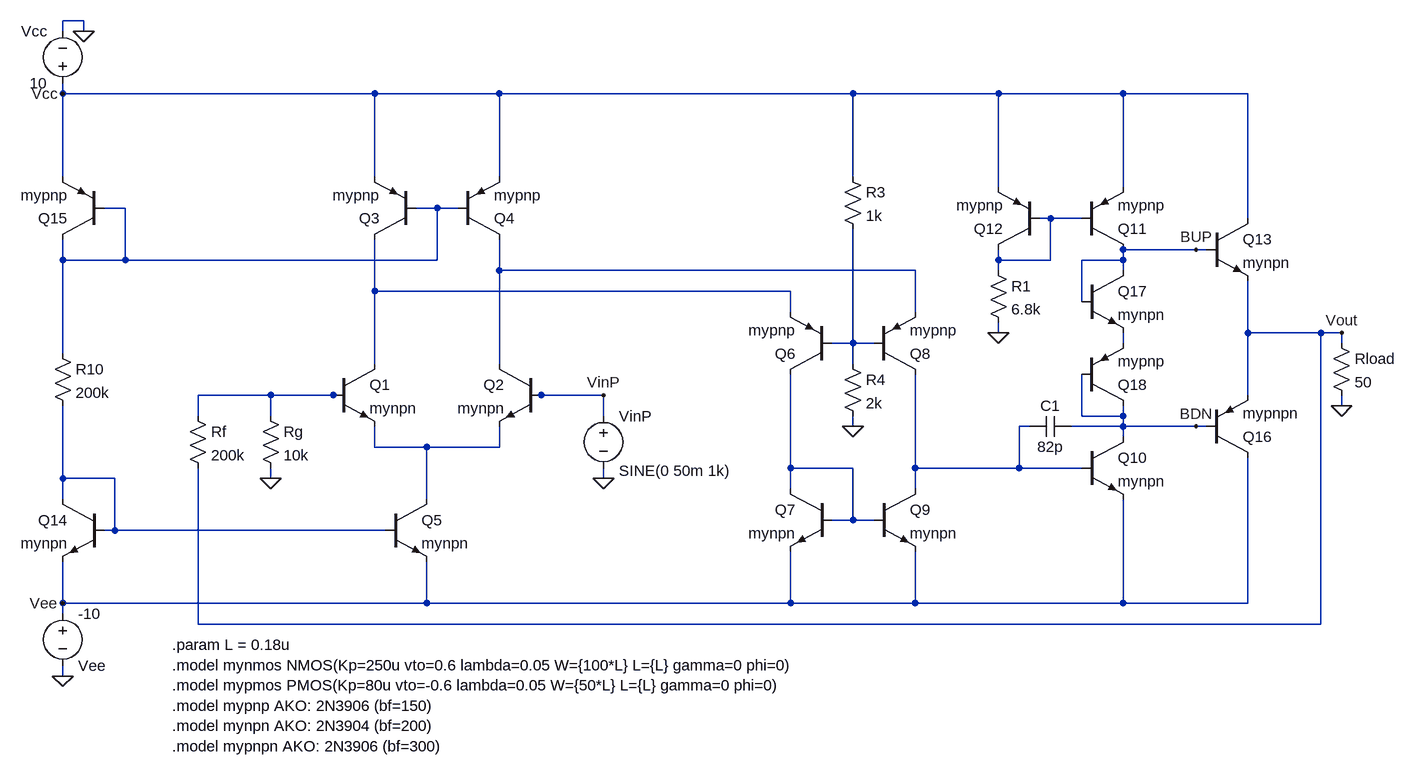
[diagram p0: schematic Ph2_403170569.asc]
Ph2_403170569.asc, the LTspice schematic file:
Version 4.1
SHEET 1 2160 844
WIRE -176 -784 -208 -784
WIRE -208 -768 -208 -784
WIRE -176 -768 -176 -784
WIRE -208 -672 -208 -688
WIRE 272 -672 -208 -672
WIRE 464 -672 272 -672
WIRE 1008 -672 464 -672
WIRE 1232 -672 1008 -672
WIRE 1424 -672 1232 -672
WIRE 1616 -672 1424 -672
WIRE -208 -544 -208 -672
WIRE 272 -544 272 -672
WIRE 464 -544 464 -672
WIRE 1008 -544 1008 -672
WIRE 1232 -528 1232 -672
WIRE 1424 -528 1424 -672
WIRE -112 -496 -144 -496
WIRE 368 -496 336 -496
WIRE 400 -496 368 -496
WIRE 1312 -480 1296 -480
WIRE 1360 -480 1312 -480
WIRE 1616 -480 1616 -672
WIRE 1536 -432 1424 -432
WIRE 1552 -432 1536 -432
WIRE -208 -416 -208 -448
WIRE -112 -416 -112 -496
WIRE -112 -416 -208 -416
WIRE 368 -416 368 -496
WIRE 368 -416 -112 -416
WIRE 1232 -416 1232 -432
WIRE 1312 -416 1312 -480
WIRE 1312 -416 1232 -416
WIRE 1424 -416 1424 -432
WIRE 1424 -416 1360 -416
WIRE 464 -400 464 -448
WIRE 1104 -400 464 -400
WIRE 1232 -400 1232 -416
WIRE 1424 -400 1424 -416
WIRE 272 -368 272 -448
WIRE 912 -368 272 -368
WIRE 1360 -352 1360 -416
WIRE 912 -336 912 -368
WIRE 1104 -336 1104 -400
WIRE 1232 -304 1232 -320
WIRE 1616 -304 1616 -384
WIRE 1728 -304 1616 -304
WIRE 1760 -304 1728 -304
WIRE 1008 -288 1008 -464
WIRE 1008 -288 976 -288
WIRE 1040 -288 1008 -288
WIRE 1424 -288 1424 -304
WIRE 1760 -288 1760 -304
WIRE -208 -272 -208 -416
WIRE 272 -256 272 -368
WIRE 464 -256 464 -400
WIRE 1008 -256 1008 -288
WIRE 112 -208 0 -208
WIRE 208 -208 112 -208
WIRE 224 -208 208 -208
WIRE 528 -208 512 -208
WIRE 624 -208 528 -208
WIRE 1616 -208 1616 -304
WIRE 1760 -192 1760 -208
WIRE 0 -176 0 -208
WIRE 112 -176 112 -208
WIRE 624 -176 624 -208
WIRE 1360 -176 1360 -240
WIRE 1424 -176 1424 -192
WIRE 1424 -176 1360 -176
WIRE 1008 -160 1008 -176
WIRE 1280 -160 1264 -160
WIRE 1424 -160 1424 -176
WIRE 1424 -160 1344 -160
WIRE 1536 -160 1424 -160
WIRE 1552 -160 1536 -160
WIRE 1424 -144 1424 -160
WIRE 272 -128 272 -160
WIRE 352 -128 272 -128
WIRE 464 -128 464 -160
WIRE 464 -128 352 -128
WIRE 912 -96 912 -240
WIRE 1008 -96 912 -96
WIRE 1104 -96 1104 -240
WIRE 1264 -96 1264 -160
WIRE 1264 -96 1104 -96
WIRE 1360 -96 1264 -96
WIRE -208 -80 -208 -192
WIRE -128 -80 -208 -80
WIRE 112 -80 112 -96
WIRE 624 -80 624 -96
WIRE 912 -64 912 -96
WIRE 1104 -64 1104 -96
WIRE -208 -48 -208 -80
WIRE 352 -48 352 -128
WIRE 1008 -16 1008 -96
WIRE 1008 -16 976 -16
WIRE 1040 -16 1008 -16
WIRE -128 0 -128 -80
WIRE -128 0 -144 0
WIRE 288 0 -128 0
WIRE -208 112 -208 48
WIRE 352 112 352 48
WIRE 352 112 -208 112
WIRE 912 112 912 32
WIRE 912 112 352 112
WIRE 1104 112 1104 32
WIRE 1104 112 912 112
WIRE 1424 112 1424 -48
WIRE 1424 112 1104 112
WIRE 1616 112 1616 -112
WIRE 1616 112 1424 112
WIRE -208 128 -208 112
WIRE 0 144 0 -96
WIRE 1728 144 1728 -304
WIRE 1728 144 0 144
WIRE -208 224 -208 208
FLAG -176 -768 0
FLAG -208 224 0
FLAG 624 -80 0
FLAG 1008 -160 0
FLAG 624 -208 VinP
FLAG 1760 -192 0
FLAG 1760 -304 Vout
FLAG 112 -80 0
FLAG -208 -672 Vcc
FLAG -208 112 Vee
FLAG 1232 -304 0
FLAG 1536 -432 BUP
FLAG 1536 -160 BDN
SYMBOL voltage -208 -672 R180
WINDOW 0 24 96 Left 2
WINDOW 3 24 16 Left 2
WINDOW 123 0 0 Left 0
WINDOW 39 0 0 Left 0
SYMATTR InstName Vcc
SYMATTR Value 10
SYMBOL voltage -208 112 R0
WINDOW 0 24 96 Left 2
WINDOW 3 24 16 Left 2
WINDOW 123 0 0 Left 0
WINDOW 39 0 0 Left 0
SYMATTR InstName Vee
SYMATTR Value -10
SYMBOL npn 208 -256 R0
SYMATTR InstName Q1
SYMATTR Value mynpn
SYMBOL npn 528 -256 M0
SYMATTR InstName Q2
SYMATTR Value mynpn
SYMBOL pnp 336 -448 R180
SYMATTR InstName Q3
SYMATTR Value mypnp
SYMBOL pnp 400 -448 M180
SYMATTR InstName Q4
SYMATTR Value mypnp
SYMBOL npn 288 -48 R0
SYMATTR InstName Q5
SYMATTR Value mynpn
SYMBOL voltage 624 -192 R0
WINDOW 3 24 100 Left 2
WINDOW 123 24 72 Left 2
WINDOW 39 0 0 Left 0
SYMATTR Value SINE(0 50m 1k)
SYMATTR InstName VinP
SYMBOL pnp 976 -240 R180
SYMATTR InstName Q6
SYMATTR Value mypnp
SYMBOL pnp 1040 -240 M180
SYMATTR InstName Q8
SYMATTR Value mypnp
SYMBOL npn 976 -64 M0
SYMATTR InstName Q7
SYMATTR Value mynpn
SYMBOL npn 1040 -64 R0
SYMATTR InstName Q9
SYMATTR Value mynpn
SYMBOL res 992 -560 R0
SYMATTR InstName R3
SYMATTR Value 1k
SYMBOL res 992 -272 R0
SYMATTR InstName R4
SYMATTR Value 2k
SYMBOL npn 1360 -144 R0
SYMATTR InstName Q10
SYMATTR Value mynpn
SYMBOL npn -144 -48 M0
SYMATTR InstName Q14
SYMATTR Value mynpn
SYMBOL res -224 -288 R0
SYMATTR InstName R10
SYMATTR Value 200k
SYMBOL pnp -144 -448 R180
SYMATTR InstName Q15
SYMATTR Value mypnp
SYMBOL npn 1552 -480 R0
SYMATTR InstName Q13
SYMATTR Value mynpn
SYMBOL pnp 1552 -112 M180
SYMATTR InstName Q16
SYMATTR Value mypnpn
SYMBOL res 1744 -304 R0
SYMATTR InstName Rload
SYMATTR Value 50
SYMBOL res -16 -192 R0
SYMATTR InstName Rf
SYMATTR Value 200k
SYMBOL res 96 -192 R0
SYMATTR InstName Rg
SYMATTR Value 10k
SYMBOL pnp 1360 -432 M180
SYMATTR InstName Q11
SYMATTR Value mypnp
SYMBOL pnp 1296 -432 R180
SYMATTR InstName Q12
SYMATTR Value mypnp
SYMBOL res 1216 -416 R0
SYMATTR InstName R1
SYMATTR Value 6.8k
SYMBOL npn 1360 -400 R0
SYMATTR InstName Q17
SYMATTR Value mynpn
SYMBOL pnp 1360 -192 M180
SYMATTR InstName Q18
SYMATTR Value mypnp
SYMBOL cap 1344 -176 R90
WINDOW 0 0 32 VBottom 2
WINDOW 3 32 32 VTop 2
SYMATTR InstName C1
SYMATTR Value 82p
TEXT -40 176 Left 2 !.param L = 0.18u\n.model mynmos NMOS(Kp=250u vto=0.6 lambda=0.05 W={100*L} L={L} gamma=0 phi=0)\n.model mypmos PMOS(Kp=80u vto=-0.6 lambda=0.05 W={50*L} L={L} gamma=0 phi=0)\n.model mypnp AKO: 2N3906 (bf=150)\n.model mynpn AKO: 2N3904 (bf=200)\n.model mypnpn AKO: 2N3906 (bf=300)

The netlist it stands for:
* Ph2_403170569.asc
Vcc Vcc 0 10
Vee Vee 0 -10
Q1 N004 N007 N009 0 mynpn
Q2 N003 VinP N009 0 mynpn
Q3 N004 N001 Vcc 0 mypnp
Q4 N003 N001 Vcc 0 mypnp
Q5 N009 N011 Vee 0 mynpn
VinP VinP 0 SINE(0 50m 1k)
Q6 N010 N005 N004 0 mypnp
Q8 N008 N005 N003 0 mypnp
Q7 N010 N010 Vee 0 mynpn
Q9 N008 N010 Vee 0 mynpn
R3 Vcc N005 1k
R4 N005 0 2k
Q10 BDN N008 Vee 0 mynpn
Q14 N011 N011 Vee 0 mynpn
R10 N001 N011 200k
Q15 N001 N001 Vcc 0 mypnp
Q13 Vcc BUP Vout 0 mynpn
Q16 Vee BDN Vout 0 mypnpn
Rload Vout 0 50
Rf N007 Vout 200k
Rg N007 0 10k
Q11 BUP N002 Vcc 0 mypnp
Q12 N002 N002 Vcc 0 mypnp
R1 N002 0 6.8k
Q17 BUP BUP N006 0 mynpn
Q18 BDN BDN N006 0 mypnp
C1 BDN N008 82p
.model NPN NPN
.model PNP PNP
.lib standard.bjt
.param L = 0.18u
.model mynmos NMOS(Kp=250u vto=0.6 lambda=0.05 W={100*L} L={L} gamma=0 phi=0)
.model mypmos PMOS(Kp=80u vto=-0.6 lambda=0.05 W={50*L} L={L} gamma=0 phi=0)
.model mypnp AKO: 2N3906 (bf=150)
.model mynpn AKO: 2N3904 (bf=200)
.model mypnpn AKO: 2N3906 (bf=300)
.backanno
.end